# EAGLE design light_sensor_and_buzzer_board (EAGLE 9.1.0)
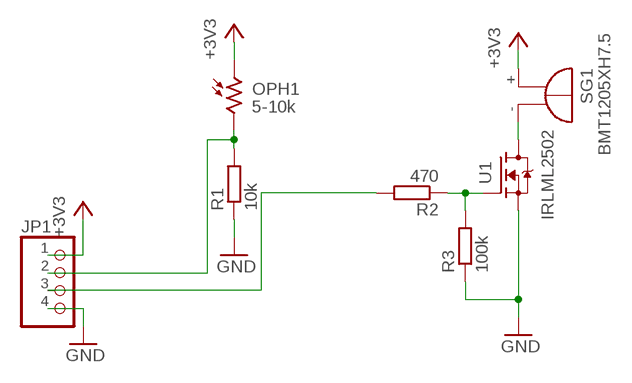
[diagram p0: schematic, sheet 1]

## Parts
JP1  PINHD-1X4  [1X04]
OPH1  5-10k  VT90N1  [VT900]
R1  10k  R-EU_R1206  [R1206]
R2  470  R-EU_R1206  [R1206]
R3  100k  R-EU_R1206  [R1206]
SG1  BMT1205XH7.5  [BMT1205XH7.5]
U1  IRLML2502  IRLML2502TRPBF  [SOT23]

## Nets
+3V3: JP1.1 OPH1.1 SG1.+
GND: JP1.4 R1.1 R3.1 U1.2(S)
N$1: JP1.2 OPH1.2 R1.2
N$2: SG1.- U1.3(D)
N$3: R2.1 R3.2 U1.1(G)
N$4: JP1.3 R2.2

## Library data of the parts
JP1 = pinhead:PINHD-1X4: PIN HEADER
OPH1 = photo-elements:VT9: Photoconductive Cell VT900 Series Source: http://optoelectronics.perkinelmer.com/content/Datasheets/DTS_vt900seriesdatasheet.pdf
R1-R3 = rcl:R-EU_: RESISTOR, European symbol; SPICEPREFIX: R
SG1 = buzzer:BMT1205XH7.5: MAGNETIC TRANSDUCER Source: Http:www.be-star.com; OC_FARNELL: unknown; OC_NEWARK: unknown
U1 = IRLML2502TRPBF:IRLML2502TRPBF; AVAILABILITY: Unavailable; DESCRIPTION: Single N-Channel 20 V 0.08 Ohm 12 nC 1.25 W Silicon SMT Mosfet - SOT-23; MF: Infineon; MP: IRLML2502TRPBF; PACKAGE: SOT-23-3 Infineon; PRICE: None

## Board
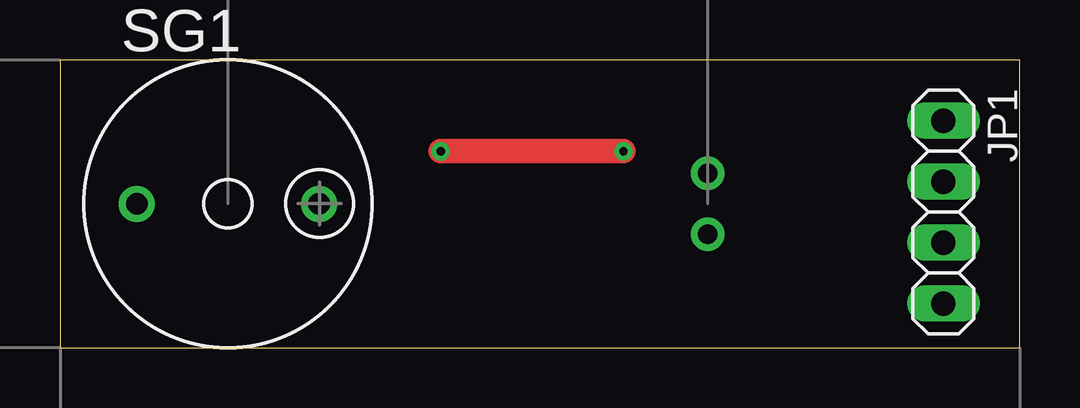
[diagram p1: board, top side]
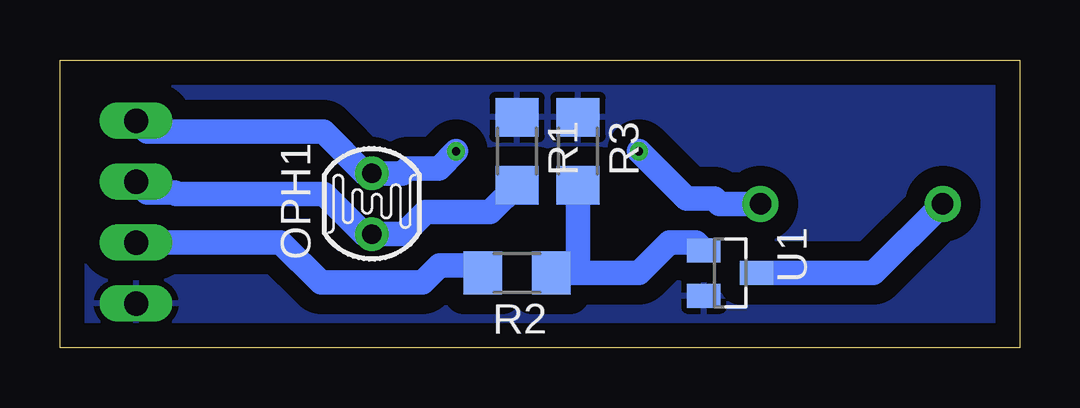
[diagram p2: board, bottom side, seen from below]

Size 40 x 12 mm. Coordinates in mm from the lower left corner, seen from the top.
Outline: 40,12 0,12 0,0 40,0 40,12
Copper layers (1*16): Top 0.035mm / dielectric 1.5mm / Bottom 0.035mm
Design rules "default *": minimum track width 6mil, minimum drill 0.35mm, track to track 32mil, track to pad 32mil, pad to pad 6mil, via to via 6mil, smd to smd 6mil, copper to edge 40mil, drill to drill 6mil, minimum pad ring 10mil, minimum via ring 8mil, stop-mask expansion 4mil, vias tented up to drill 0mil, thermal gap 10mil

### Footprints (pad centres in the part's own frame; a part is rotated, then mirrored left to right if it is on the bottom)
1X04 = drill 1.016 long: 1 -3.81,0; 2 -1.27,0; 3 1.27,0; 4 3.81,0
VT900 = drill 0.8 pad 1.4: 1 -1.27,0; 2 1.27,0
R1206 = smd 1.6 x 1.803: 1 -1.422,0; 2 1.422,0
BMT1205XH7.5 = drill 0.9 pad 1.5: + 3.8,0; - -3.8,0
SOT23 = smd 1 x 1.4: 1 -0.95,-1.1; 2 0.95,-1.1; 3 0,1.1

### Placement (x,y rotation side)
JP1  36.83,5.65 270 top
OPH1  27,6 270 bottom
R1  20.95,8.19 270 bottom
R2  20.95,3.11 180 bottom
R3  18.41,8.19 270 bottom
SG1  7,6 0 top
U1  12.06,3.11 270 bottom

### Tracks (layer width: path | path; a pad name or v marks a point on that pad's centre or on a via)
+3V3  (via drill 0.35)
  Top 1.016: v23.49,8.19 v15.87,8.19
  Bottom 1.016: JP1.1 36.37,9 29,9 27.27,7.27 OPH1.1 25.73,7.27 25.52,7.48 24.2,7.48 v23.49,8.19 | v15.87,8.19 13.89,6.21 12.72,6.21 12.51,6 SG1.+
GND
  pour Bottom: 40,13 -0.64,13 -0.64,-2.97 40,-2.97
N$1
  Bottom 1.016: JP1.2 36.37,6.46 35.2,6.46 35.15,6.41 29,6.41 27.32,4.73 | 27.32,4.73 OPH1.2 | R1.2 22.07,5.65 24.76,5.65 25.68,4.73 27.32,4.73
N$2
  Bottom 1.016: SG1.- 6.09,3.11 U1.3
N$3
  Bottom 1.016: R2.1 18.41,3.11 | 18.41,3.11 15.87,3.11 14.6,4.38 13.48,4.38 U1.1 | R3.2 18.41,3.11
N$4
  Bottom 1.016: JP1.3 30.79,4.38 29.12,2.71 24.89,2.71 24.17,3.43 22.69,3.43 R2.2